# Altium schematic sheet voeding.SchDoc
size A4; SheetNumber: 2; SheetTotal: 4
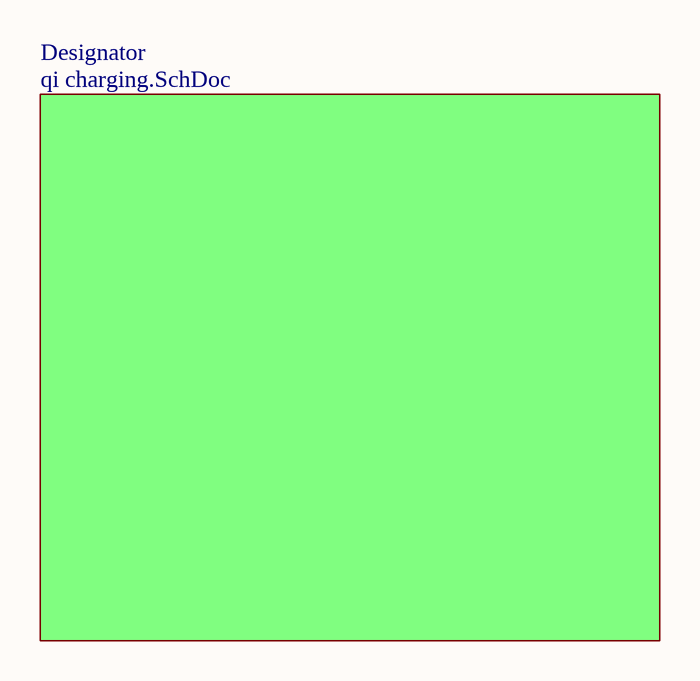
[diagram p0: voeding.SchDoc]

## Sub-sheets
Designator = qi charging.SchDoc: no entries